# Altium schematic sheet LCD.SchDoc: 20x4 Characters LCD
size A4
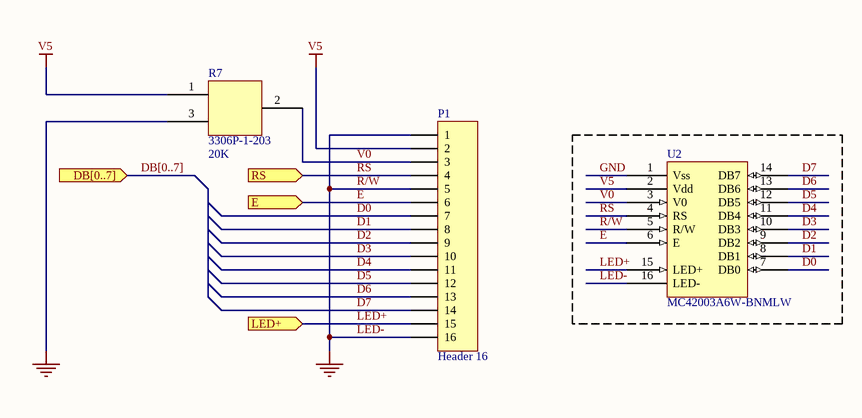
[diagram p0: LCD.SchDoc]

## Parts
P1  Header 16  [MC42004A6W-BNMLW]  (mechanical)
R7  3306P-1-203  value 20K  [3306P-1-202]
U2  MC42003A6W-BNMLW  [MC42004A6W-BNMLW]

## Ports
DB[0..7] (in), E (in), LED+ (in), RS (in)

## Nets
GND: P1.1 P1.5 P1.16 R7.3 U2.1(Vss) U2.5(R/W) U2.16(LED-)  [also labelled LED-, R/W]
V5: P1.2 R7.1 U2.2(Vdd)
D0: P1.7 U2.7(DB0)
D1: P1.8 U2.8(DB1)
D2: P1.9 U2.9(DB2)
D3: P1.10 U2.10(DB3)
D4: P1.11 U2.11(DB4)
D5: P1.12 U2.12(DB5)
D6: P1.13 U2.13(DB6)
D7: P1.14 U2.14(DB7)
E: P1.6 U2.6(E) ; port E
LED+: P1.15 U2.15(LED+) ; port LED+
RS: P1.4 U2.4(RS) ; port RS
V0: P1.3 R7.2 U2.3(V0)

## Buses and harness runs
bus DB[0..7] = port DB[0..7]

## Notes on the sheet
- Title
- Size:
- Date:
- A4
- Number:
- Time:
- Revision:
- Sheet
- of
- File:

## Library data of the parts
P1 = Header 16: Header, 16-Pin; Fabricant: SAMTEC; Fournisseur: Farnell; RefFabricant: CES-116-01-T-S; RefFournisseur: 1667522
R7 = 3306P-1-202: Trimpot; RefFournisseur: 108240; Fabricant: Bourns; Fournisseur: Farnell; RefFabricant: 3306P-1-203
U2 = MC42003A6W-BNMLW: LCD; Fabricant: MIDAS; Fournisseur: Farnell; RefFournisseur: 2063162; RefFabricant: MC42004A6W-BNMLW